# Altium schematic sheet Power_Board_3790.SchDoc
size A4
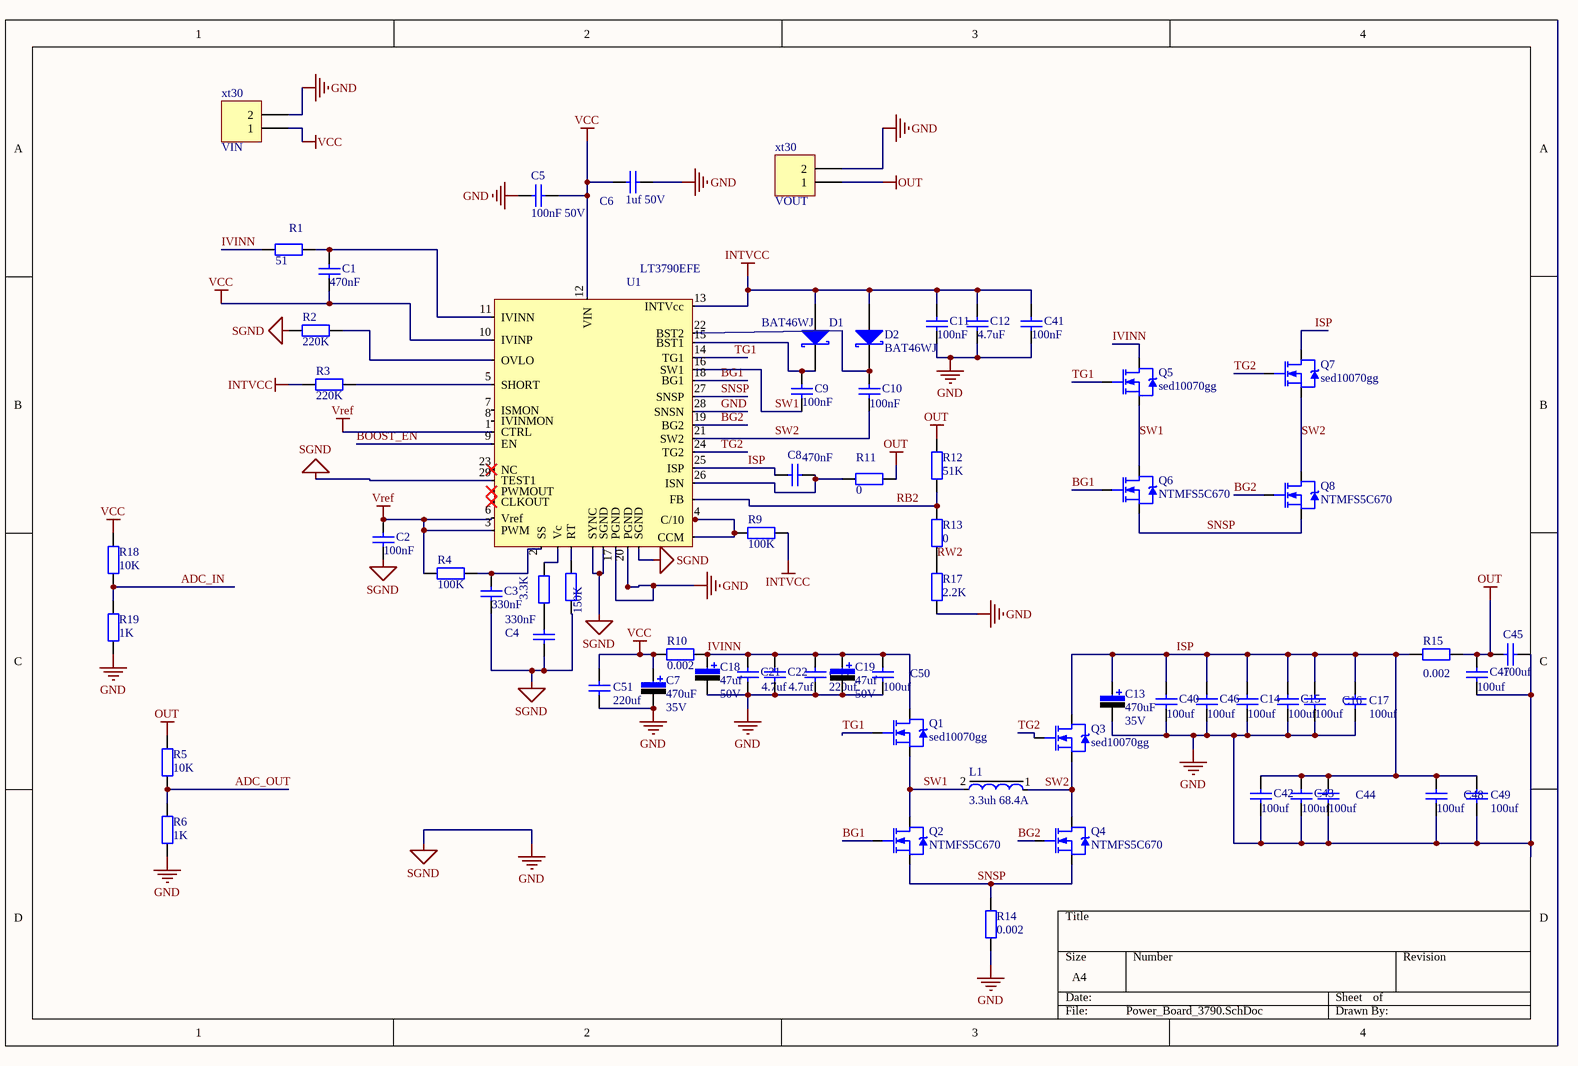
[diagram p0: Power_Board_3790.SchDoc]

## Parts
C1  470nF  [c0402]
C2  100nF  [c0402]
C3  330nF  [c0402]
C4  330nF  [c0402]
C5  100nF 50V  [c0402]
C6  1uf 50V  [0805-2]
C7  value 470uF  Vol: 35V  [C10X10]  (hidden comment: 470uF 35v)
C8  470nf  [c0402]
C9  100nF  [c0402]
C10  100nF  [c0402]
C11  100nF  [c0402]
C12  4.7uF  [c0402]
C13  value 470uF  Vol: 35V  [C10X10]  (hidden comment: 470uf 35V)
C14  100uf  [1210]
C15  100uf  [1210]
C16  100uf  [1210]
C17  100uf  [1210]
C18  Vol: 50V  [6.3*7.7MM]  (hidden comment: 47uf)
C19  Vol: 50V  [6.3*7.7MM]  (hidden comment: 47uf)
C21  4.7uf  [1210]
C22  4.7uf  [1210]
C39  220uf  [1210]
C40  100uf  [1210]
C41  100nF  [c0402]
C42  100uf  [1210]
C43  100uf  [1210]
C44  100uf  [1210]
C45  100uf  [1210]
C46  100uf  [1210]
C47  100uf  [1210]
C48  100uf  [1210]
C49  100uf  [1210]
C50  100uf  [1210]
C51  220uf  [1210]
D1  Type: BAT46WJ  [sod323]  (hidden comment: D-Schottky)
D2  Type: BAT46WJ  [sod323]  (hidden comment: D-Schottky)
L1  L: 3.3uh 68.4A  [SER-2900]  (hidden comment: 10uH)
Q1  sed10070gg  [pg-tdson-8]
Q2  NTMFS5C670  [pg-tdson-8]
Q3  sed10070gg  [pg-tdson-8]
Q4  NTMFS5C670  [pg-tdson-8]
Q5  sed10070gg  [pg-tdson-8]
Q6  NTMFS5C670  [pg-tdson-8]
Q7  sed10070gg  [pg-tdson-8]
Q8  NTMFS5C670  [pg-tdson-8]
R1  51  [r0402]
R2  220K  [r0402]
R3  220K  [r0402]
R4  100K  [r0402]
R5  10K  [r0402]
R6  1K  [r0402]
R7  3.3K  [r0402]
R8  150K  [r0402]
R9  100K  [r0402]
R10  0.002  [2512]
R11  0  [r0402]
R12  51K  [r0402]
R13  0  [r0402]
R14  0.002  [2512]
R15  0.002  [2512]
R17  2.2K  [r0402]
R18  10K  [r0402]
R19  1K  [r0402]
U1  LT3790EFE  [TSSOP38]
VIN  xt30  [XT30-M]
VOUT  xt30  [XT30-M]

## Nets
GND: C2.1 C3.1 C4.1 C5.1 C6.1 C7.2 C11.1 C12.1 C13.2 C14.1 C15.1 C16.1 C17.1 C18.2 C19.2 C21.1 C22.1 C39.1 C40.1 C41.1 C42.1 C43.1 C44.1 C45.2 C46.1 C47.1 C48.1 C49.1 C50.1 C51.1 R2.1 R6.2 R8.1 R14.2 R17.1 R19.2 U1.17(PGND) U1.20(PGND) U1.28(SNSN) U1.29(TEST1) U1.30(SGND) U1.34(SYNC) U1.39(SGND) VIN.2 VOUT.2  [also labelled SGND]
INTVCC: C11.2 C12.2 C41.2 D1.1(A) D2.1(A) R3.1 R9.2 U1.13(INTVcc)
OUT: C45.1 C47.2 R5.2 R11.2 R12.2 R15.2 VOUT.1
VCC: C1.1 C5.2 C6.2 C7.1 C51.2 R10.1 R18.2 U1.10(IVINP) U1.12(VIN) VIN.1
Vref: C2.2 R4.1 U1.1(CTRL) U1.3(PWM) U1.6(Vref)
ADC_IN: R18.1 R19.1
ADC_OUT: R5.1 R6.1
BG1: Q2.1(G) Q6.1(G) U1.18(BG1)
BG2: Q4.1(G) Q8.1(G) U1.19(BG2)
BOOST_EN: U1.9(EN)
ISP: C8.2 C13.1 C14.2 C15.2 C16.2 C17.2 C40.2 C42.2 C43.2 C44.2 C46.2 C48.2 C49.2 Q3.2(D) Q7.2(D) R15.1 U1.25(ISP)
IVINN: C18.1 C19.1 C21.2 C22.2 C39.2 C50.2 Q1.2(D) Q5.2(D) R1.1 R10.2
RB2: R12.1 R13.1 U1.37(FB)
RW2: R13.2 R17.2
SNSP: Q2.3(S) Q4.3(S) Q6.3(S) Q8.3(S) R14.1 U1.27(SNSP)
SW1: C9.1 L1.2 Q1.3(S) Q2.2(D) Q5.3(S) Q6.2(D) U1.16(SW1)
SW2: C10.1 L1.1 Q3.3(S) Q4.2(D) Q7.3(S) Q8.2(D) U1.21(SW2)
TG1: Q1.1(G) Q5.1(G) U1.14(TG1)
TG2: Q3.1(G) Q7.1(G) U1.24(TG2)
NetC1_2: C1.2 R1.2 U1.11(IVINN)
NetC3_2: C3.2 R4.2 U1.2(SS)
NetC4_2: C4.2 R7.1
NetC8_1: C8.1 R11.1 U1.26(ISN)
NetC9_2: C9.2 D1.2(K) U1.15(BST1)
NetC10_2: C10.2 D2.2(K) U1.22(BST2)
NetR2_2: R2.2 U1.38(OVLO)
NetR3_2: R3.2 U1.5(SHORT)
NetR7_2: R7.2 U1.36(Vc)
NetR8_2: R8.2 U1.35(RT)
NetR9_1: R9.1 U1.4(C/10) U1.32(CCM)

Not connected (* = marked no-connect by the designer): U1 7(ISMON) 8(IVINMON) 23(NC)* 31(PWMOUT)* 33(CLKOUT)*

## Library data of the parts
C1-C6 C8-C12 C14-C17 C21 C22 C39-C51 = Cap: 无极性电容; Published: 8-Jun-2000; LatestRevisionDate: 17-Jul-2002; LatestRevisionNote: Re-released for DXP Platform.; PackageReference: RAD-0.3; Publisher: Altium Limited
  C1 C8: Value: 470nF
  C2 C9-C11 C41: Value: 100nF
  C3 C4: Value: 330nF
  C5: Value: 100nF 50V
  C6: Value: 1uf 50V
  C12: Value: 4.7uF
  C14-C17 C40 C42-C50: Value: 100uf
  C21 C22: Value: 4.7uf
  C39 C51: Value: 220uf
C7 C13 C18 C19 = Cap Pol: 极性电解电容; Published: 8-Jun-2000; LatestRevisionDate: 17-Jul-2002; LatestRevisionNote: Re-released for DXP Platform.; PackageReference: RB7.6-15; Publisher: Altium Limited
  C18 C19: Value: 47uf
D1 D2 = D-Schottky: 肖特基二极管; Published: 8-Jun-2000; LatestRevisionDate: 17-Jul-2002; LatestRevisionNote: Re-released for DXP Platform.; PackageReference: SMB; Publisher: Altium Limited; Code_JEDEC: DO-214-AA
L1 = L: 扁铜线功率电感
Q1-Q8 = NMOS-2: MOS; Note: Pin 2 is electrically connected to pin 4.; Published: 8-Jun-2000; LatestRevisionDate: 17-Jul-2002; LatestRevisionNote: Re-released for DXP Platform.; DatasheetVersion: PD-9.814; PackageVersion: Feb-1997; PackageReference: TO-220AB; Publisher: Altium Limited; PackageDescription: TO, Thru-Hole, Vertical, Heatsink Mounted; 3 In-Line Leads; Pitch 2.54 mm; ComponentLink1Description: Manufacturer Link; ComponentLink1URL: http://www.irf.com/
R1-R14 R17-R19 = Res1: 贴片电阻; Published: 8-Jun-2000; LatestRevisionDate: 17-Jul-2002; LatestRevisionNote: Re-released for DXP Platform.; PackageReference: AXIAL-0.4; Publisher: Altium Limited
  R1: Value: 51
  R2 R3: Value: 220K
  R4 R9: Value: 100K
  R5 R18: Value: 10K
  R6 R19: Value: 1K
  R7: Value: 3.3K
  R8: Value: 150K
  R10 R14: Value: 0.002
  R11 R13: Value: 0
  R12: Value: 51K
  R17: Value: 2.2K
R15 = Res1: 贴片电阻; Value: 0.004; Published: 8-Jun-2000; LatestRevisionDate: 17-Jul-2002; LatestRevisionNote: Re-released for DXP Platform.; PackageReference: AXIAL-0.4; Publisher: Altium Limited
U1 = LT3790: DC-DC芯片
VIN VOUT = Header 2: 接插件; LatestRevisionDate: 17-Jul-2002; LatestRevisionNote: Re-released for DXP Platform.; Publisher: Altium Limited